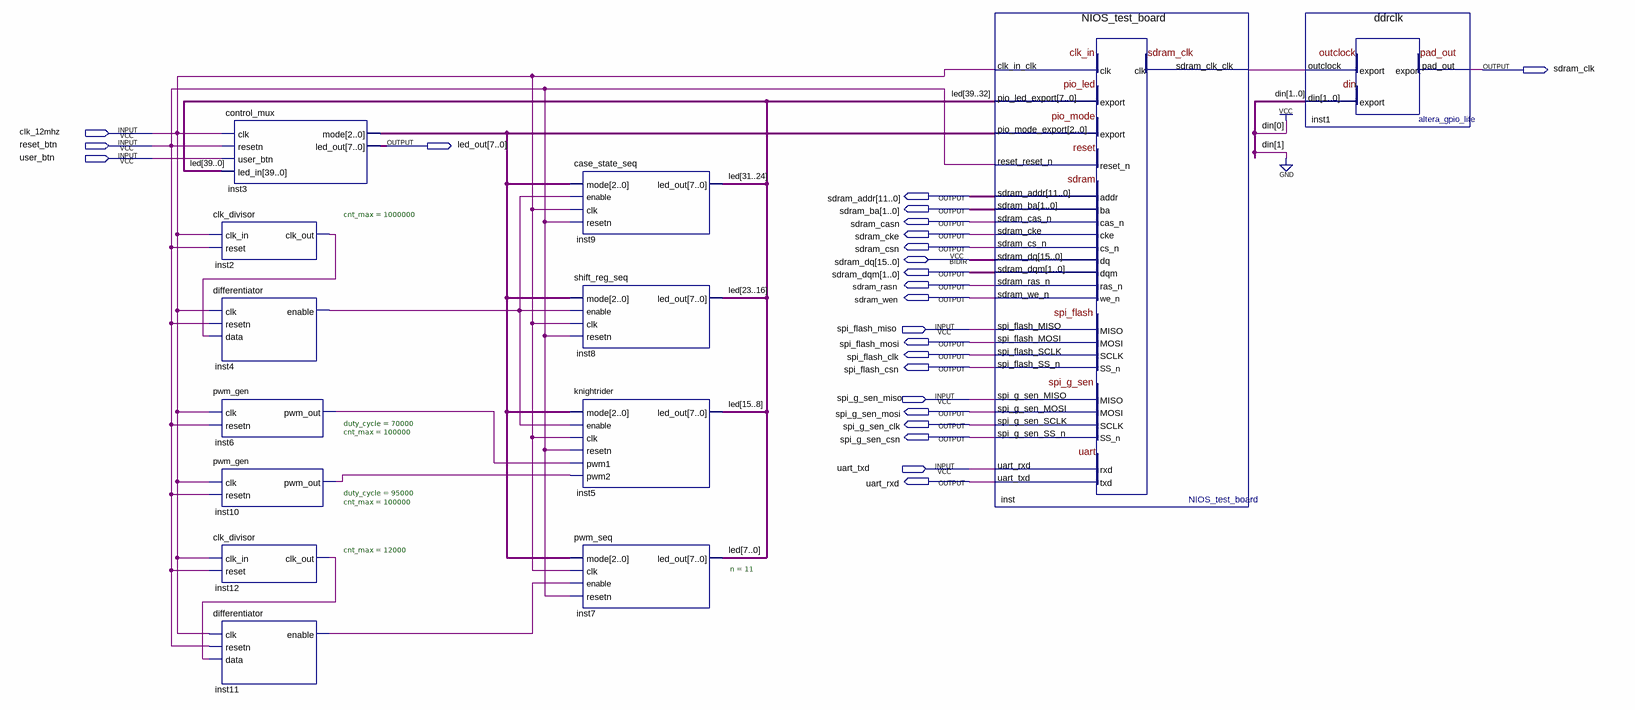
[diagram p0: schematic sheet]
// Quartus schematic test_board.bdf as structural Verilog: 13 symbols, 24 pins
module test_board (
  input  clk_12mhz,
  input  reset_btn,
  input  user_btn,
  input  spi_flash_miso,
  input  spi_g_sen_miso,
  input  uart_txd,
  inout  [15:0] sdram_dq,
  output sdram_clk,
  output [7:0] led_out,
  output [11:0] sdram_addr,
  output [1:0] sdram_ba,
  output sdram_casn,
  output sdram_cke,
  output sdram_csn,
  output [1:0] sdram_dqm,
  output sdram_rasn,
  output sdram_wen,
  output spi_flash_mosi,
  output spi_flash_clk,
  output spi_flash_csn,
  output spi_g_sen_mosi,
  output spi_g_sen_clk,
  output spi_g_sen_csn,
  output uart_rxd
);

  wire inst2_clk_out, inst4_enable, inst6_pwm_out, inst10_pwm_out, inst11_enable, inst12_clk_out,
       inst_sdram_clk_clk;
  wire [2:0] inst3_mode;
  wire [39:0] led;

  control_mux inst3 (
    .clk(clk_12mhz), .resetn(reset_btn), .user_btn(user_btn), .led_in(led), .mode(inst3_mode),
    .led_out(led_out));
  clk_divisor #(.cnt_max(1000000)) inst2 (.clk_in(clk_12mhz), .reset(reset_btn), .clk_out(inst2_clk_out));
  differentiator inst4 (.clk(clk_12mhz), .resetn(reset_btn), .data(inst2_clk_out), .enable(inst4_enable));
  pwm_gen #(.duty_cycle(70000), .cnt_max(100000)) inst6 (.clk(clk_12mhz), .resetn(reset_btn), .pwm_out(inst6_pwm_out));
  pwm_gen #(.duty_cycle(95000), .cnt_max(100000)) inst10 (
    .clk(clk_12mhz), .resetn(reset_btn), .pwm_out(inst10_pwm_out));
  clk_divisor #(.cnt_max(12000)) inst12 (.clk_in(clk_12mhz), .reset(reset_btn), .clk_out(inst12_clk_out));
  differentiator inst11 (.clk(clk_12mhz), .resetn(reset_btn), .data(inst12_clk_out), .enable(inst11_enable));
  case_state_seq inst9 (
    .mode(inst3_mode), .enable(inst4_enable), .clk(clk_12mhz), .resetn(reset_btn), .led_out(led[31:24]));
  shift_reg_seq inst8 (
    .mode(inst3_mode), .enable(inst4_enable), .clk(clk_12mhz), .resetn(reset_btn), .led_out(led[23:16]));
  knightrider inst5 (
    .mode(inst3_mode), .enable(inst4_enable), .clk(clk_12mhz), .resetn(reset_btn), .pwm1(inst6_pwm_out),
    .pwm2(inst10_pwm_out), .led_out(led[15:8]));
  pwm_seq #(.n(11)) inst7 (
    .mode(inst3_mode), .clk(clk_12mhz), .enable(inst11_enable), .resetn(reset_btn), .led_out(led[7:0]));
  NIOS_test_board inst (
    .clk_in_clk(clk_12mhz), .pio_mode_export(inst3_mode), .reset_reset_n(reset_btn),
    .spi_flash_MISO(spi_flash_miso), .spi_g_sen_MISO(spi_g_sen_miso), .uart_rxd(uart_txd),
    .pio_led_export(led[39:32]), .sdram_addr(sdram_addr), .sdram_ba(sdram_ba), .sdram_cas_n(sdram_casn),
    .sdram_cke(sdram_cke), .sdram_cs_n(sdram_csn), .sdram_dqm(sdram_dqm), .sdram_ras_n(sdram_rasn),
    .sdram_we_n(sdram_wen), .sdram_clk_clk(inst_sdram_clk_clk), .spi_flash_MOSI(spi_flash_mosi),
    .spi_flash_SCLK(spi_flash_clk), .spi_flash_SS_n(spi_flash_csn), .spi_g_sen_MOSI(spi_g_sen_mosi),
    .spi_g_sen_SCLK(spi_g_sen_clk), .spi_g_sen_SS_n(spi_g_sen_csn), .uart_txd(uart_rxd), .sdram_dq(sdram_dq));
  ddrclk inst1 (.outclock(inst_sdram_clk_clk), .din(2'b01), .pad_out(sdram_clk));
endmodule
